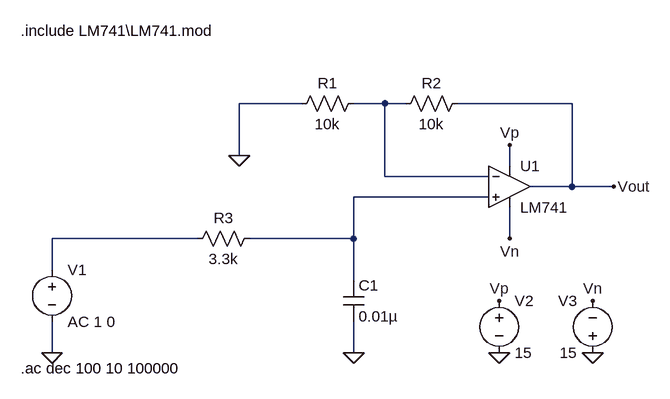
[diagram p0: schematic Draft4.asc]
Draft4.asc, the LTspice schematic file:
Version 4
SHEET 1 880 680
WIRE 192 64 96 64
WIRE 320 64 272 64
WIRE 352 64 320 64
WIRE 608 64 432 64
WIRE 96 144 96 64
WIRE 512 160 512 128
WIRE 320 176 320 64
WIRE 480 176 320 176
WIRE 608 192 608 64
WIRE 608 192 544 192
WIRE 672 192 608 192
WIRE 480 208 272 208
WIRE 32 272 -192 272
WIRE 272 272 272 208
WIRE 272 272 112 272
WIRE 512 272 512 224
WIRE -192 320 -192 272
WIRE 272 336 272 272
WIRE -192 448 -192 400
WIRE 272 448 272 400
FLAG 272 448 0
FLAG -192 448 0
FLAG 96 144 0
FLAG 672 192 Vout
FLAG 512 128 Vp
FLAG 512 272 Vn
FLAG 496 368 Vp
FLAG 640 368 Vn
FLAG 496 448 0
FLAG 640 448 0
SYMBOL res 288 48 R90
WINDOW 0 0 56 VBottom 2
WINDOW 3 32 56 VTop 2
SYMATTR InstName R1
SYMATTR Value 10k
SYMBOL res 448 48 R90
WINDOW 0 0 56 VBottom 2
WINDOW 3 32 56 VTop 2
SYMATTR InstName R2
SYMATTR Value 10k
SYMBOL res 128 256 R90
WINDOW 0 0 56 VBottom 2
WINDOW 3 32 56 VTop 2
SYMATTR InstName R3
SYMATTR Value 3.3k
SYMBOL cap 256 336 R0
SYMATTR InstName C1
SYMATTR Value 0.01µ
SYMBOL voltage -192 304 R0
WINDOW 123 0 0 Left 0
WINDOW 39 0 0 Left 0
SYMATTR InstName V1
SYMATTR Value AC 1 0
SYMBOL OpAmps\\opamp2 512 128 R0
SYMATTR InstName U1
SYMATTR Value LM741
SYMBOL voltage 496 352 R0
WINDOW 123 0 0 Left 0
WINDOW 39 0 0 Left 0
SYMATTR InstName V2
SYMATTR Value 15
SYMBOL voltage 640 464 R180
WINDOW 0 24 96 Left 2
WINDOW 3 24 16 Left 2
WINDOW 123 0 0 Left 0
WINDOW 39 0 0 Left 0
SYMATTR InstName V3
SYMATTR Value 15
TEXT -240 -48 Left 2 !.include LM741\\LM741.mod
TEXT -240 472 Left 2 !.ac dec 100 10 100000

The netlist it stands for:
* Draft4.asc
R1 N001 0 10k
R2 Vout N001 10k
R3 N002 N003 3.3k
C1 N002 0 0.01µ
V1 N003 0 AC 1 0
XU1 N002 N001 Vp Vn Vout LM741  ; pins In+ In- V+ V- OUT
V2 Vp 0 15
V3 0 Vn 15
.include LM741\LM741.mod
.ac dec 100 10 100000
.backanno
.end